# EAGLE design ssr-breakout (EAGLE 6.4)
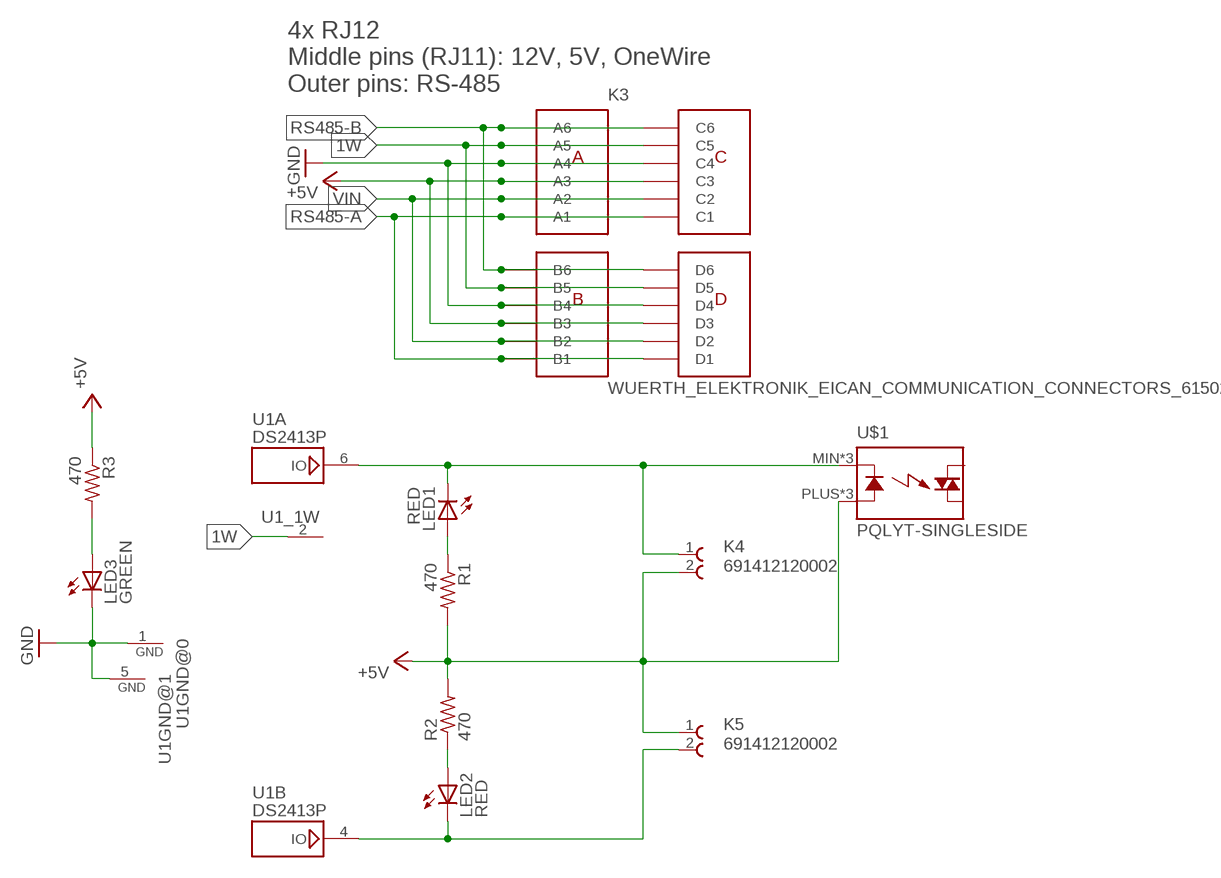
[diagram p0: schematic, sheet 1]

## Parts
K3  WUERTH_ELEKTRONIK_EICAN_COMMUNICATION_CONNECTORS_615024143921  [WUERTH_ELEKTRONIK_EICAN_COMMUNICATION_CONNECTORS_615024143921]
K4  691412120002  [691412120002]
K5  691412120002  [691412120002]
LED1  RED  SPARKFUN-LED_LED-BLUE1206  [SPARKFUN-LED_LED-1206]
LED2  RED  SPARKFUN-LED_LED-BLUE1206  [SPARKFUN-LED_LED-1206]
LED3  GREEN  SPARKFUN-LED_LED-BLUE1206  [SPARKFUN-LED_LED-1206]
R1  470  R-US_R0805  [R0805]
R2  470  R-US_R0805  [R0805]
R3  470  R-US_R0805  [R0805]
U1  DS2413P  [TSOC6]
U$1  PQLYT-SINGLESIDE  [PQLYT-PADS-ONLY]

## Nets
1W: K3.A5 K3.B5 K3.C5 K3.D5 U1.2
+5V: K3.A3 K3.B3 K3.C3 K3.D3 K4.2 K5.1 R1.2 R2.2 R3.1 U$1.PLUS(A) U$1.PLUSBOTTOM(A) U$1.PLUSTOP(A)
GND: K3.A4 K3.B4 K3.C4 K3.D4 LED3.C U1.1 U1.5
N$1: K4.1 LED1.C U1.6 U$1.MIN(K) U$1.MINBOTTOM(K) U$1.MINTOP(K)
N$2: LED1.A R1.1
N$3: LED2.A R2.1
N$4: K5.2 LED2.C U1.4
N$5: LED3.A R3.2
RS485-A: K3.A1 K3.B1 K3.C1 K3.D1
RS485-B: K3.A6 K3.B6 K3.C6 K3.D6
VIN: K3.A2 K3.B2 K3.C2 K3.D2

## Notes on the sheet
- 4x RJ12
  Middle pins (RJ11): 12V, 5V, OneWire
  Outer pins: RS-485

## Library data of the parts
K3 = brewpi-spark-shield-revA-v04:WUERTH_ELEKTRONIK_EICAN_COMMUNICATION_CONNECTORS_615024143921: WR-MJ Horizontal Plastic 4 Port 6P6C Modular Jack Tab Up, 24 pins=>Code : Con_I-O_MJ-H_Plastic_Up_615024143921 <http://katalog.we-online.de/media/images/eican/Con_I-O_MJ-H_Plastic_Up_615024143921_pf2.jpg> Details see: http://katalog.we-online.de/en/em/615_024_143_921 Created 2014-07-10, Karrer Zheng 2014 (C) Würth Elektronik
K4 K5 = Wuerth_Elektronik_eiCan_Terminal_Blocks_Connectors:691412120002: WR-TBL Serie 412 - 3.5mm Screwless 45° Entry Grey - 1.5mm2 Wires, 4 Pins
LED1-LED3 = brewpi-spark-shield-revA-v04:SPARKFUN-LED_LED-BLUE: Blue LEDs for production use Various blue LEDs stocked by SparkFun production 0603 - DIO-08575 Rebel - DIO-09553 1206 - DIO-09911; PROD_ID: DIO-09911; VALUE: BLUE
R1-R3 = adafruit:R-US_: RESISTOR, American symbol
U1 = 1wire:DS2413: Dual Channel Addressable Switch This chip is similar to the DS2405 chip, but provides two PIO channels with 20mA sinking capability and an on-resistance of 20Ohm for each open drain output. Up to 28V can be switched. Note: Both GND pins must be connected to 0V. Author: Jan Kandziora <jjj@gmx.de>
U$1 = brewpi:PQLYT-SINGLESIDE

## Net classes
0 default: width 0.152 mm, drill 0.305 mm, clearance 0.152 mm

## Board
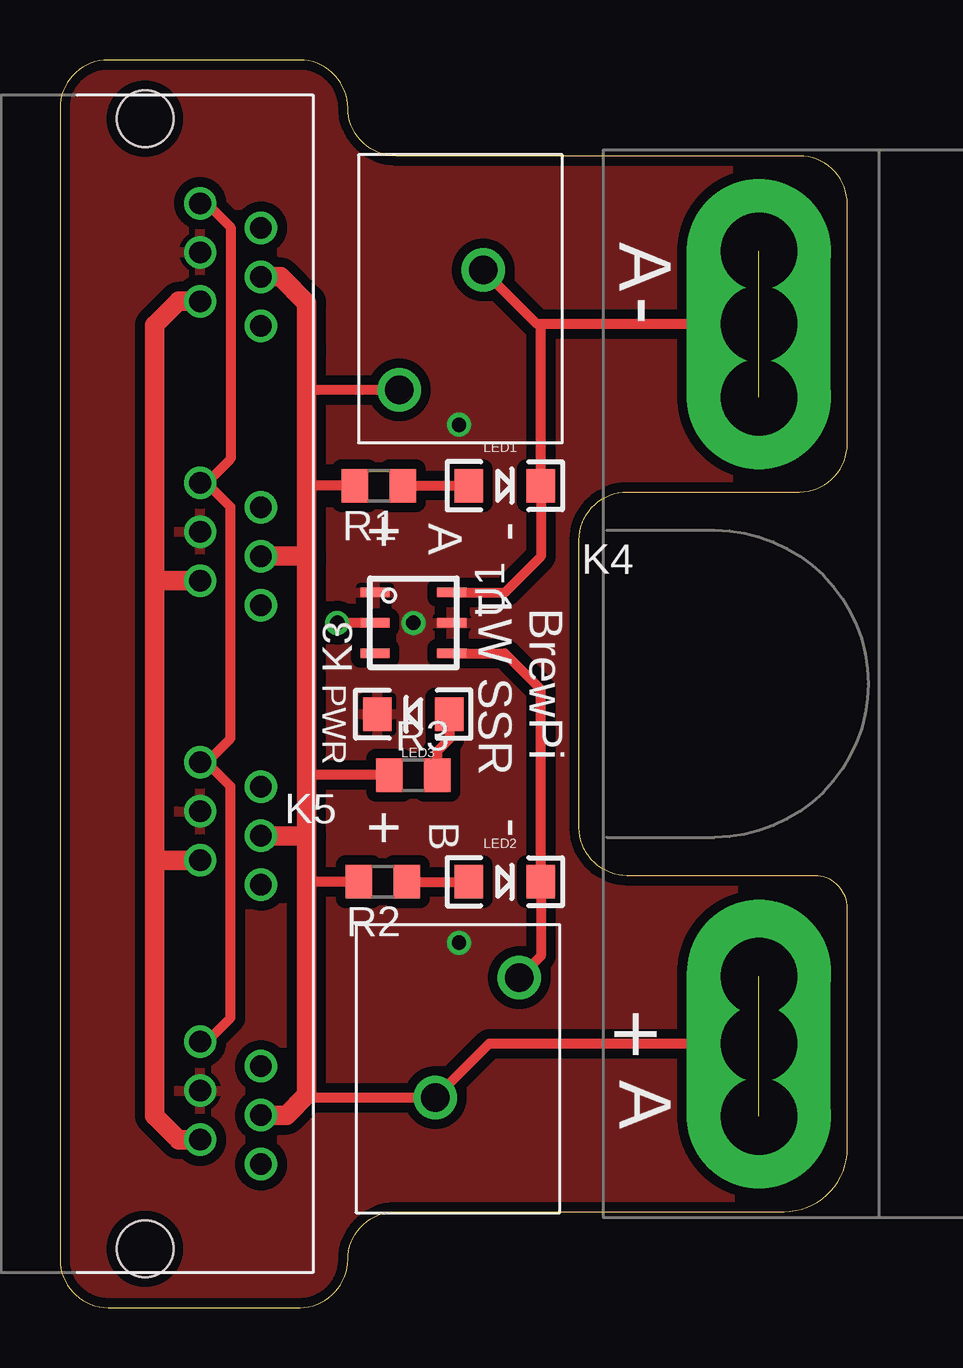
[diagram p1: board, top side]
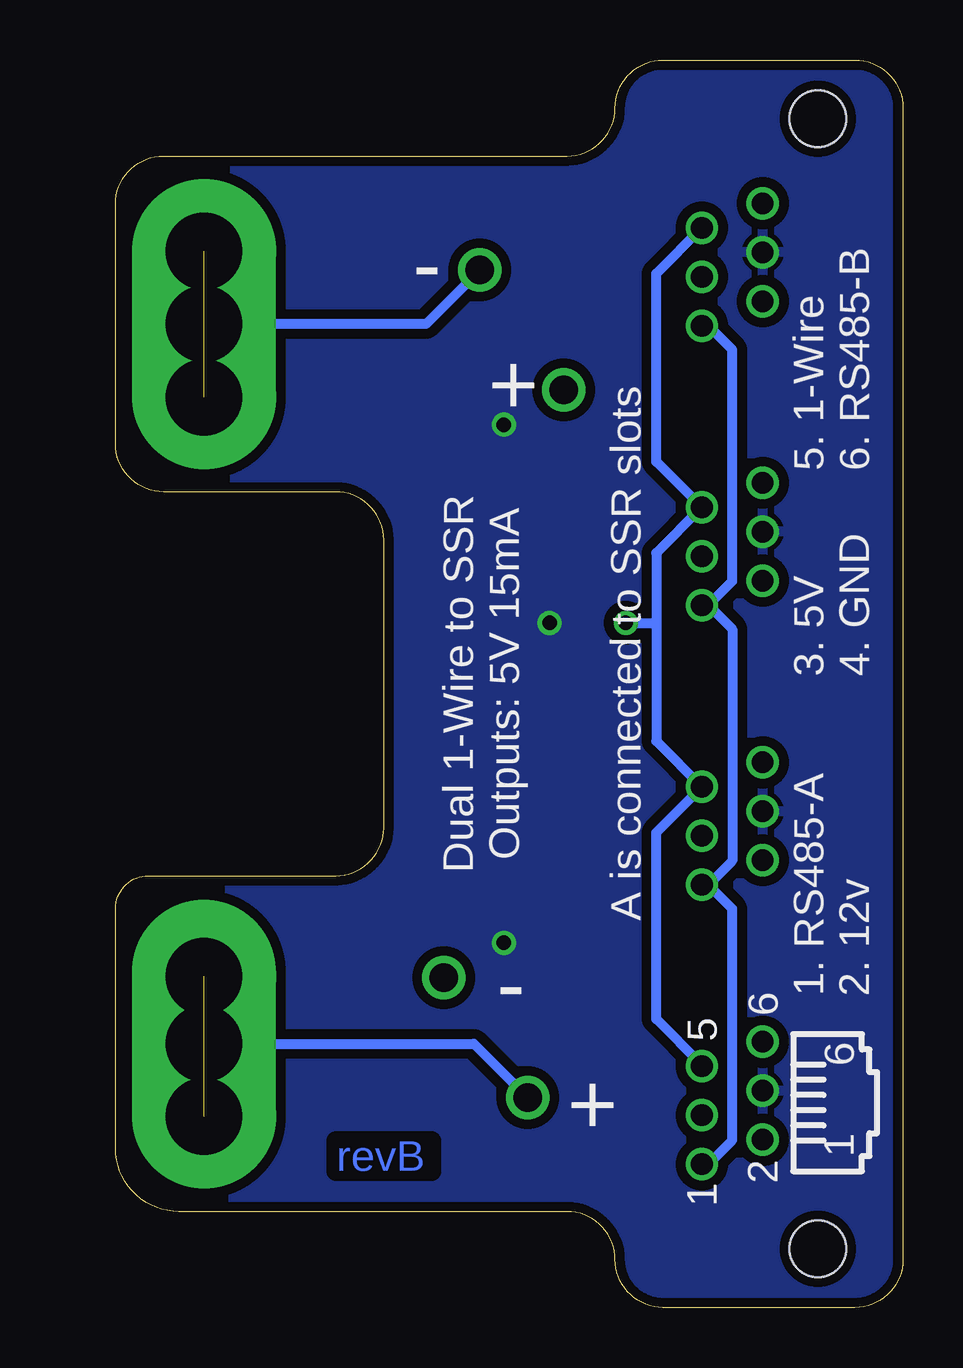
[diagram p2: board, bottom side, seen from below]

Size 32.83 x 52 mm. Coordinates in mm from the lower left corner, seen from the top.
Outline: 2,0 10,0 arc90 12,2 arc-90 14,4 30.19,4 arc90 32.83,6.63 32.83,16.64 arc90 31.46,18 23.64,18 arc-90 21.64,20 21.64,32 arc-90 23.64,34 30.82,34 arc90 32.83,36 32.83,46 arc90 30.82,48 14,48 arc-90 12,50 arc90 10,52 2,52 arc90 0,50 0,2 arc90 2,0
Copper layers (1*16): Top 0.018mm / dielectric 1.55mm / Bottom 0.018mm
Design rules "eC_2Layer_PClass6_BaseCopperO18_eCDefault *": minimum track width 0.15mm, minimum drill 0.35mm, track to track 0.15mm, track to pad 0.15mm, pad to pad 0.15mm, via to via 0.15mm, smd to smd 0mil, copper to edge 0.25mm, drill to drill 0.35mm, minimum pad ring 0.175mm, minimum via ring 0.125mm, stop-mask expansion 0mil, vias tented up to drill 0.6mm, thermal gap 0.2mm

### Footprints (pad centres in the part's own frame; a part is rotated, then mirrored left to right if it is on the bottom)
WUERTH_ELEKTRONIK_EICAN_COMMUNICATION_CONNECTORS_615024143921 = drill 0.9: A1 -14.925,1.27; A2 -15.945,-1.27; A3 -16.965,1.27; A4 -17.985,-1.27; A5 -19.005,1.27; A6 -20.025,-1.27; B1 -3.275,1.27; B2 -4.295,-1.27; B3 -5.315,1.27; B4 -6.335,-1.27; B5 -7.355,1.27; B6 -8.375,-1.27; C1 8.375,1.27; C2 7.355,-1.27; C3 6.335,1.27; C4 5.315,-1.27; C5 4.295,1.27; C6 3.275,-1.27; D1 20.025,1.27; D2 19.005,-1.27; D3 17.985,1.27; D4 16.965,-1.27; D5 15.945,1.27; D6 14.925,-1.27 | hole 2.36: -23.55,-3.57; 23.55,-3.57
691412120002 = drill 1.2: 1 0,0; 2 3.5,5
SPARKFUN-LED_LED-1206 = smd 1.2 x 1.4: A -1.5,0; C 1.5,0
R0805 = smd 1.1 x 1.4: 1 -1,0; 2 1,0
TSOC6 = smd 0.406 x 1.219: 1 -1.27,-1.6; 2 0,-1.6; 3 1.27,-1.6; 4 1.27,1.6; 5 0,1.6; 6 -1.27,1.6
PQLYT-PADS-ONLY = drill 3.2 pad 6 long: MIN 0,15; PLUS 0,-15 | drill 3.2 pad 6: MINBOTTOM 0,11.938; MINTOP 0,18.034; PLUSBOTTOM 0,-18.034; PLUSTOP 0,-12.192

### Placement (x,y rotation side)
K3  7.11,26 270 top
K4  17.64,43.25 180 top
K5  15.64,8.75 0 top
LED1  18.54,34.26 0 top
LED2  18.54,17.75 0 top
LED3  14.73,24.73 180 top
R1  13.29,34.26 180 top
R2  13.46,17.75 180 top
R3  14.73,22.19 0 top
U1  14.73,28.54 270 top
U$1  29.14,26 0 top

### Tracks (layer width: path | path; a pad name or v marks a point on that pad's centre or on a via)
1W  (via drill 0.6 pad 1)
  Top 0.406: U1.2 v11.56,28.54
  Bottom 0.406: K3.D5 8.38,10.12 10.29,12.03 10.29,19.8 K3.C5 10.29,23.61 10.29,28.54 | 10.29,28.54 10.29,31.45 K3.B5 10.29,35.26 10.29,43.1 K3.A5 | v11.56,28.54 10.29,28.54
+5V  (2 unrouted)
  Top 0.406: 10.21,31.32 10.29,31.32 10.29,31.08 | 10.49,39.77 10.29,39.97 | R2.2 10.29,17.75 | R3.1 10.29,22.19 | R1.2 10.29,34.26 | 10.29,8.86 10.39,8.75 K5.1 17.89,11 U$1.PLUS | K4.2 10.47,38.25 10.29,38.06
  Top 0.813: K3.D3 9.45,8.02 10.29,8.86 10.29,17.75 10.29,19.65 | 10.29,19.65 10.29,22.19 10.29,31.08 10.29,34.26 10.29,38.06 10.29,39.97 10.29,41.88 9.2,42.97 K3.A3 | K3.C3 10.27,19.66 10.29,19.65 | K3.B3 10.21,31.32 10.29,31.4
  Bottom 0.406: U$1.PLUS 17.89,11 K5.1
GND  (via drill 0.6 pad 1)
  other vias: 16.64,36.8 16.64,15.21 14.73,28.54
  pour Top (isolate 0.406): -5.16,-1.4 41.14,-1 41.14,53.06 -5.16,53.06
  pour Bottom (isolate 0.406): -5.16,-1.4 41.14,-1 41.14,53.06 -5.16,53.06
N$1  (2 unrouted)
  Top 0.406: U1.6 18.54,29.81 20.04,31.31 LED1.C 20.04,41 | U$1.MIN 20.04,41 | 20.04,41 19.89,41 K4.1
  Bottom 0.406: K4.1 19.89,41 28.07,41
N$2
  Top 0.406: R1.1 LED1.A
N$3
  Top 0.406: R2.1 LED2.A
N$4
  Top 0.406: K5.2 20.04,14.65 LED2.C 20.04,25.77 18.54,27.27 U1.4
N$5
  Top 0.406: LED3.A 16.23,23.69 15.73,23.19 R3.2
RS485-A
  Bottom 0.406: K3.D1 8.11,5.97 7.11,6.97 7.11,16.62 8.11,17.62 | 8.11,29.27 7.11,28.27 7.11,18.62 8.11,17.62 | K3.C1 8.11,17.62 | K3.B1 8.11,29.27 | 8.11,29.27 7.11,30.27 7.11,39.92 8.11,40.92 K3.A1
RS485-B
  Top 0.406: K3.D6 6.11,11.07 7.11,12.07 7.11,21.73 6.11,22.73 | K3.C6 6.11,22.73 | 6.11,22.73 7.11,23.73 7.11,33.38 6.11,34.38 | K3.B6 6.11,34.38 | 6.11,34.38 7.11,35.38 7.11,45.02 6.11,46.02 K3.A6
VIN
  Top 0.813: K3.D2 4.94,7 3.94,8 3.94,18.38 | 3.94,18.38 3.94,30.13 | 3.94,30.13 3.94,40.95 4.94,41.95 K3.A2 | K3.B2 4.11,30.3 3.94,30.13 | K3.C2 4.2,18.64 3.94,18.38

### Text on the board
Bottom: revB
tPlace: A | - | A | + | - | PWR | BrewPi / 1W SSR | + | B | - | + | A
bPlace: - | + | 6. RS485-B | 5. 1-Wire | A is connected to SSR slots | 4. GND | 3. 5V | Dual 1-Wire to SSR / Outputs: 5V 15mA | - | 2. 12v | 1. RS485-A | 6 | 5 | 6 | + | 1 | 2 | 1